# Altium schematic sheet Main.SchDoc
size A3
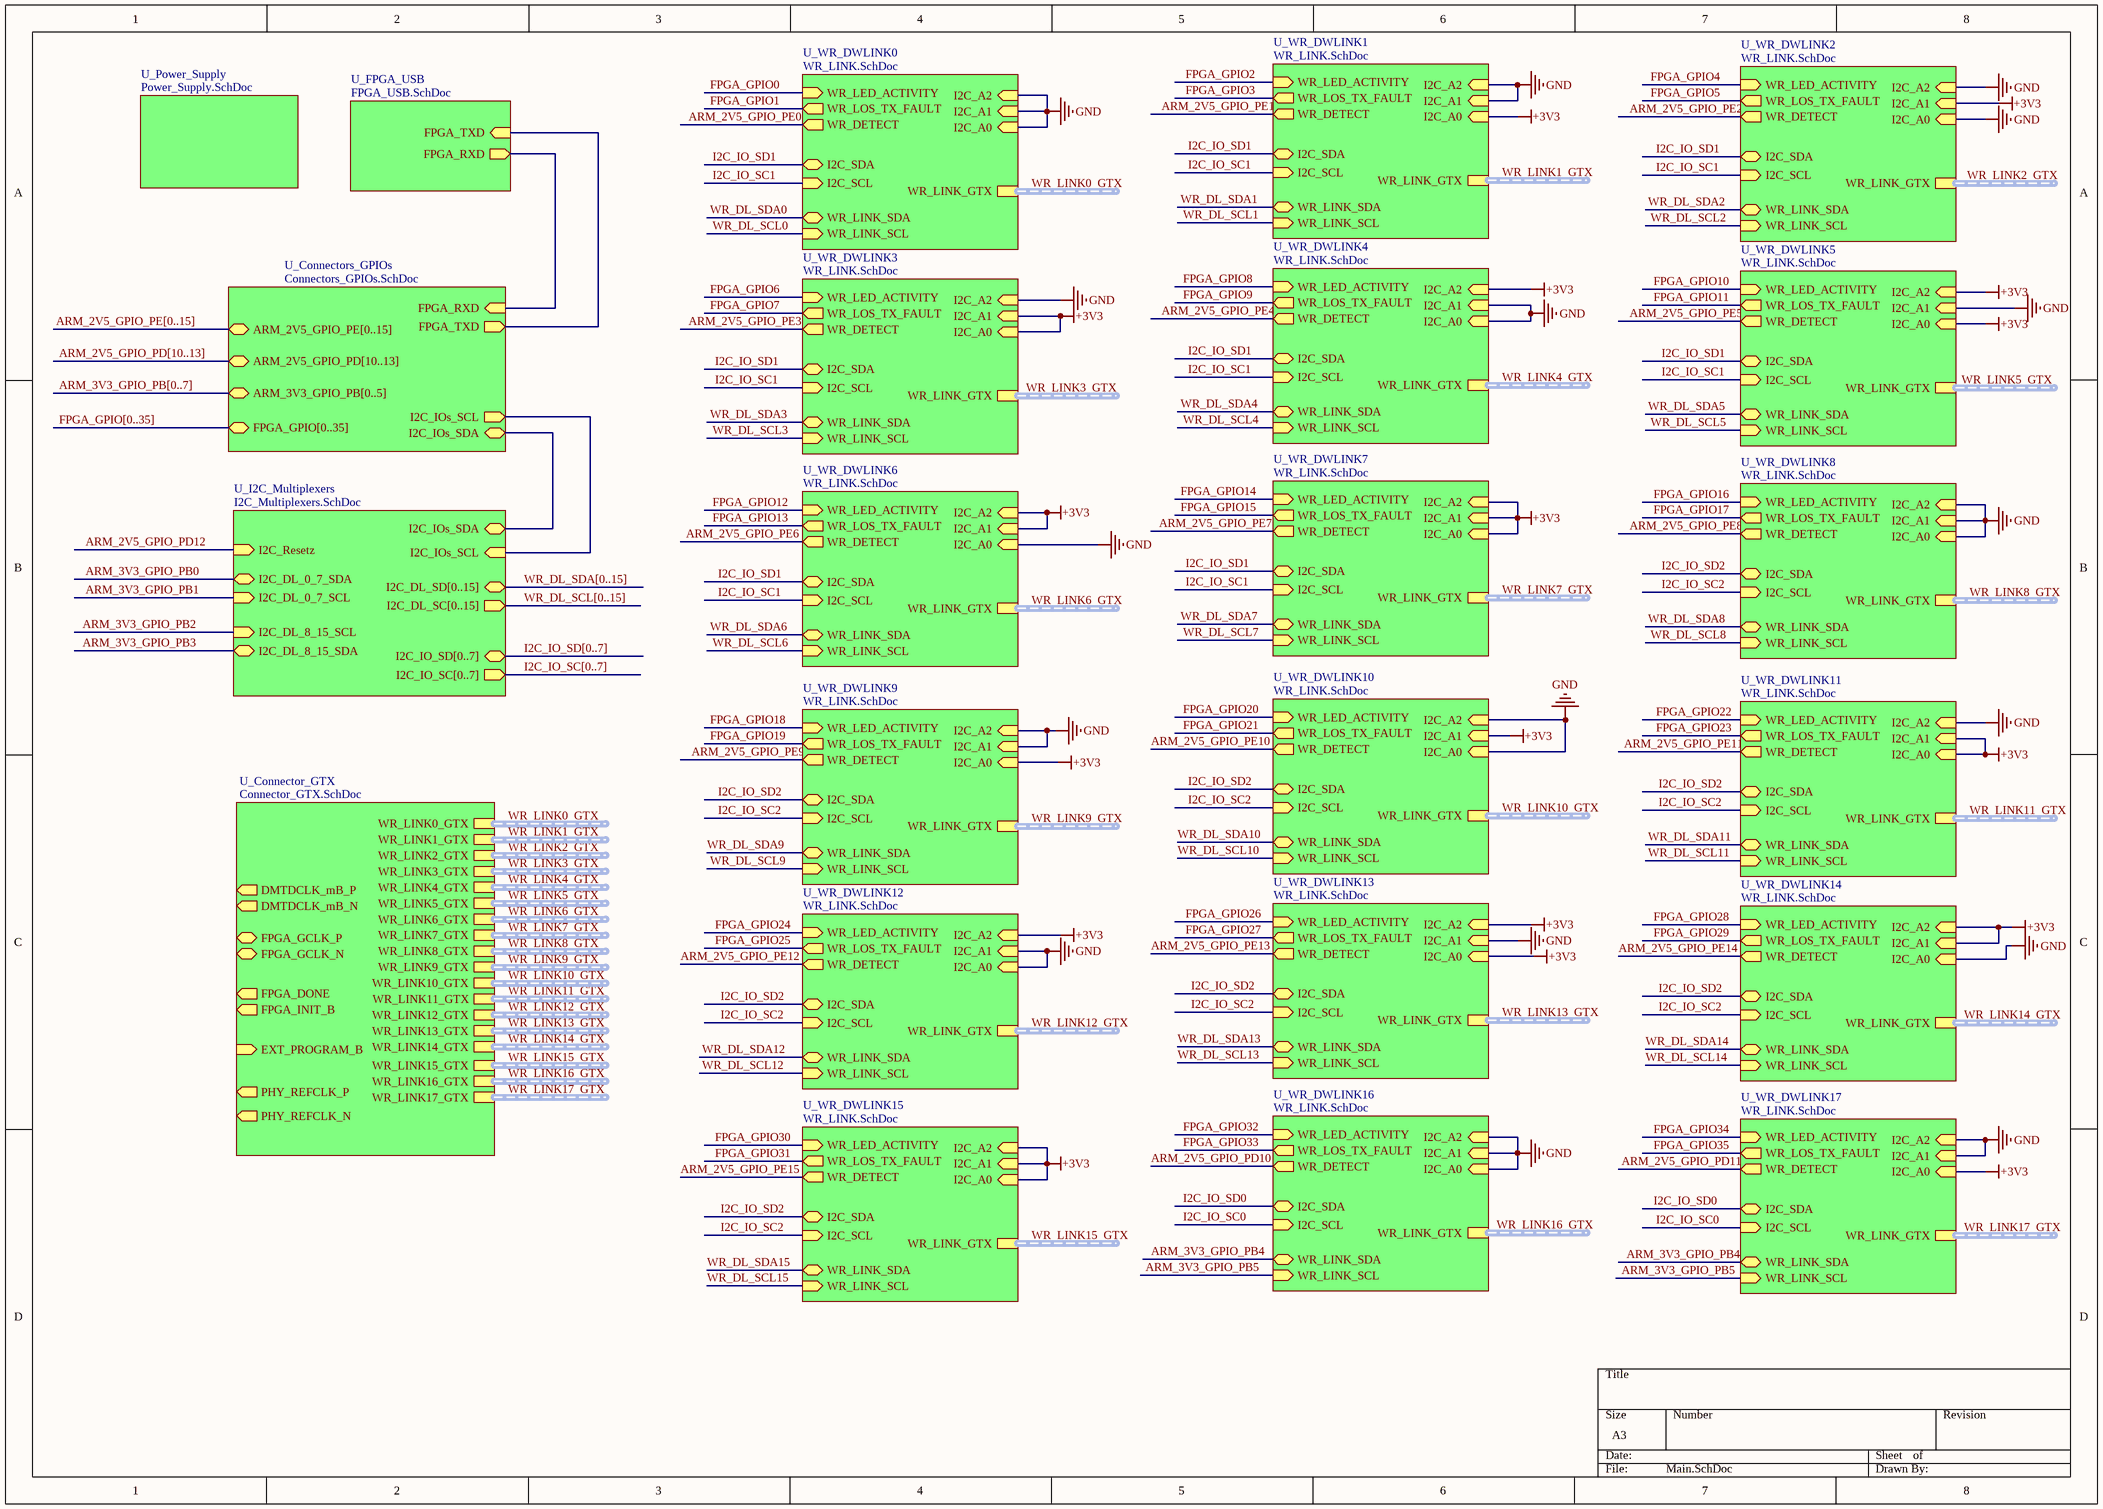
[diagram p0: Main.SchDoc]

## Sub-sheets
U_Connector_GTX = Connector_GTX.SchDoc: DMTDCLK_mB_P (out), DMTDCLK_mB_N (out), FPGA_GCLK_P (bidir), FPGA_GCLK_N (bidir), EXT_PROGRAM_B (in), FPGA_DONE (out), FPGA_INIT_B (out), PHY_REFCLK_P (out), PHY_REFCLK_N (out), WR_LINK0_GTX (harness WR_LINK_GTX), WR_LINK1_GTX (harness WR_LINK_GTX), WR_LINK2_GTX (harness WR_LINK_GTX), WR_LINK3_GTX (harness WR_LINK_GTX), WR_LINK4_GTX (harness WR_LINK_GTX), WR_LINK5_GTX (harness WR_LINK_GTX), WR_LINK6_GTX (harness WR_LINK_GTX), WR_LINK7_GTX (harness WR_LINK_GTX), WR_LINK8_GTX (harness WR_LINK_GTX), WR_LINK9_GTX (harness WR_LINK_GTX), WR_LINK10_GTX (harness WR_LINK_GTX), WR_LINK11_GTX (harness WR_LINK_GTX), WR_LINK17_GTX (harness WR_LINK_GTX), WR_LINK16_GTX (harness WR_LINK_GTX), WR_LINK15_GTX (harness WR_LINK_GTX), WR_LINK14_GTX (harness WR_LINK_GTX), WR_LINK13_GTX (harness WR_LINK_GTX), WR_LINK12_GTX (harness WR_LINK_GTX)
U_Connectors_GPIOs = Connectors_GPIOs.SchDoc: FPGA_RXD (in), FPGA_TXD (out), ARM_2V5_GPIO_PE[0..15] (bidir), FPGA_GPIO[0..35] (bidir), I2C_IOs_SCL (out), I2C_IOs_SDA (bidir), ARM_2V5_GPIO_PD[10..13] (bidir), ARM_3V3_GPIO_PB[0..5] (bidir)
U_FPGA_USB = FPGA_USB.SchDoc: FPGA_RXD (out), FPGA_TXD (in)
U_I2C_Multiplexers = I2C_Multiplexers.SchDoc: I2C_DL_SD[0..15] (bidir), I2C_DL_SC[0..15] (out), I2C_IO_SD[0..7] (bidir), I2C_IO_SC[0..7] (out), I2C_DL_0_7_SDA (bidir), I2C_DL_0_7_SCL (in), I2C_DL_8_15_SCL (in), I2C_DL_8_15_SDA (bidir), I2C_IOs_SCL (in), I2C_IOs_SDA (bidir), I2C_Resetz (in)
U_Power_Supply = Power_Supply.SchDoc: no entries
U_WR_DWLINK0 = WR_LINK.SchDoc: WR_LINK_GTX (harness WR_LINK_GTX), I2C_A0 (in), I2C_A1 (in), I2C_A2 (in), I2C_SCL (in), I2C_SDA (bidir), WR_LINK_SDA (bidir), WR_LINK_SCL (in), WR_LOS_TX_FAULT (out), WR_LED_ACTIVITY (in), WR_DETECT (out)
U_WR_DWLINK1 = WR_LINK.SchDoc: WR_LINK_GTX (harness WR_LINK_GTX), I2C_A0 (in), I2C_A1 (in), I2C_A2 (in), I2C_SCL (in), I2C_SDA (bidir), WR_LINK_SDA (bidir), WR_LINK_SCL (in), WR_LOS_TX_FAULT (out), WR_LED_ACTIVITY (in), WR_DETECT (out)
U_WR_DWLINK2 = WR_LINK.SchDoc: WR_LINK_GTX (harness WR_LINK_GTX), I2C_A0 (in), I2C_A1 (in), I2C_A2 (in), I2C_SCL (in), I2C_SDA (bidir), WR_LINK_SDA (bidir), WR_LINK_SCL (in), WR_LOS_TX_FAULT (out), WR_LED_ACTIVITY (in), WR_DETECT (out)
U_WR_DWLINK3 = WR_LINK.SchDoc: WR_LINK_GTX (harness WR_LINK_GTX), I2C_A0 (in), I2C_A1 (in), I2C_A2 (in), I2C_SCL (in), I2C_SDA (bidir), WR_LINK_SDA (bidir), WR_LINK_SCL (in), WR_LOS_TX_FAULT (out), WR_LED_ACTIVITY (in), WR_DETECT (out)
U_WR_DWLINK4 = WR_LINK.SchDoc: WR_LINK_GTX (harness WR_LINK_GTX), I2C_A0 (in), I2C_A1 (in), I2C_A2 (in), I2C_SCL (in), I2C_SDA (bidir), WR_LINK_SDA (bidir), WR_LINK_SCL (in), WR_LOS_TX_FAULT (out), WR_LED_ACTIVITY (in), WR_DETECT (out)
U_WR_DWLINK5 = WR_LINK.SchDoc: WR_LINK_GTX (harness WR_LINK_GTX), I2C_A0 (in), I2C_A1 (in), I2C_A2 (in), I2C_SCL (in), I2C_SDA (bidir), WR_LINK_SDA (bidir), WR_LINK_SCL (in), WR_LOS_TX_FAULT (out), WR_LED_ACTIVITY (in), WR_DETECT (out)
U_WR_DWLINK6 = WR_LINK.SchDoc: WR_LINK_GTX (harness WR_LINK_GTX), I2C_A0 (in), I2C_A1 (in), I2C_A2 (in), I2C_SCL (in), I2C_SDA (bidir), WR_LINK_SDA (bidir), WR_LINK_SCL (in), WR_LOS_TX_FAULT (out), WR_LED_ACTIVITY (in), WR_DETECT (out)
U_WR_DWLINK7 = WR_LINK.SchDoc: WR_LINK_GTX (harness WR_LINK_GTX), I2C_A0 (in), I2C_A1 (in), I2C_A2 (in), I2C_SCL (in), I2C_SDA (bidir), WR_LINK_SDA (bidir), WR_LINK_SCL (in), WR_LOS_TX_FAULT (out), WR_LED_ACTIVITY (in), WR_DETECT (out)
U_WR_DWLINK8 = WR_LINK.SchDoc: WR_LINK_GTX (harness WR_LINK_GTX), I2C_A0 (in), I2C_A1 (in), I2C_A2 (in), I2C_SCL (in), I2C_SDA (bidir), WR_LINK_SDA (bidir), WR_LINK_SCL (in), WR_LOS_TX_FAULT (out), WR_LED_ACTIVITY (in), WR_DETECT (out)
U_WR_DWLINK9 = WR_LINK.SchDoc: WR_LINK_GTX (harness WR_LINK_GTX), I2C_A0 (in), I2C_A1 (in), I2C_A2 (in), I2C_SCL (in), I2C_SDA (bidir), WR_LINK_SDA (bidir), WR_LINK_SCL (in), WR_LOS_TX_FAULT (out), WR_LED_ACTIVITY (in), WR_DETECT (out)
U_WR_DWLINK10 = WR_LINK.SchDoc: WR_LINK_GTX (harness WR_LINK_GTX), I2C_A0 (in), I2C_A1 (in), I2C_A2 (in), I2C_SCL (in), I2C_SDA (bidir), WR_LINK_SDA (bidir), WR_LINK_SCL (in), WR_LOS_TX_FAULT (out), WR_LED_ACTIVITY (in), WR_DETECT (out)
U_WR_DWLINK11 = WR_LINK.SchDoc: WR_LINK_GTX (harness WR_LINK_GTX), I2C_A0 (in), I2C_A1 (in), I2C_A2 (in), I2C_SCL (in), I2C_SDA (bidir), WR_LINK_SDA (bidir), WR_LINK_SCL (in), WR_LOS_TX_FAULT (out), WR_LED_ACTIVITY (in), WR_DETECT (out)
U_WR_DWLINK12 = WR_LINK.SchDoc: WR_LINK_GTX (harness WR_LINK_GTX), I2C_A0 (in), I2C_A1 (in), I2C_A2 (in), I2C_SCL (in), I2C_SDA (bidir), WR_LINK_SDA (bidir), WR_LINK_SCL (in), WR_LOS_TX_FAULT (out), WR_LED_ACTIVITY (in), WR_DETECT (out)
U_WR_DWLINK13 = WR_LINK.SchDoc: WR_LINK_GTX (harness WR_LINK_GTX), I2C_A0 (in), I2C_A1 (in), I2C_A2 (in), I2C_SCL (in), I2C_SDA (bidir), WR_LINK_SDA (bidir), WR_LINK_SCL (in), WR_LOS_TX_FAULT (out), WR_LED_ACTIVITY (in), WR_DETECT (out)
U_WR_DWLINK14 = WR_LINK.SchDoc: WR_LINK_GTX (harness WR_LINK_GTX), I2C_A0 (in), I2C_A1 (in), I2C_A2 (in), I2C_SCL (in), I2C_SDA (bidir), WR_LINK_SDA (bidir), WR_LINK_SCL (in), WR_LOS_TX_FAULT (out), WR_LED_ACTIVITY (in), WR_DETECT (out)
U_WR_DWLINK15 = WR_LINK.SchDoc: WR_LINK_GTX (harness WR_LINK_GTX), I2C_A0 (in), I2C_A1 (in), I2C_A2 (in), I2C_SCL (in), I2C_SDA (bidir), WR_LINK_SDA (bidir), WR_LINK_SCL (in), WR_LOS_TX_FAULT (out), WR_LED_ACTIVITY (in), WR_DETECT (out)
U_WR_DWLINK16 = WR_LINK.SchDoc: WR_LINK_GTX (harness WR_LINK_GTX), I2C_A0 (in), I2C_A1 (in), I2C_A2 (in), I2C_SCL (in), I2C_SDA (bidir), WR_LINK_SDA (bidir), WR_LINK_SCL (in), WR_LOS_TX_FAULT (out), WR_LED_ACTIVITY (in), WR_DETECT (out)
U_WR_DWLINK17 = WR_LINK.SchDoc: WR_LINK_GTX (harness WR_LINK_GTX), I2C_A0 (in), I2C_A1 (in), I2C_A2 (in), I2C_SCL (in), I2C_SDA (bidir), WR_LINK_SDA (bidir), WR_LINK_SCL (in), WR_LOS_TX_FAULT (out), WR_LED_ACTIVITY (in), WR_DETECT (out)

## Nets
+3V3: sheet U_WR_DWLINK1/I2C_A0, sheet U_WR_DWLINK2/I2C_A1, sheet U_WR_DWLINK3/I2C_A0, sheet U_WR_DWLINK3/I2C_A1, sheet U_WR_DWLINK4/I2C_A2, sheet U_WR_DWLINK5/I2C_A0, sheet U_WR_DWLINK5/I2C_A2, sheet U_WR_DWLINK11/I2C_A0, sheet U_WR_DWLINK11/I2C_A1, sheet U_WR_DWLINK14/I2C_A1, sheet U_WR_DWLINK14/I2C_A2, sheet U_WR_DWLINK17/I2C_A0, sheet U_WR_DWLINK13/I2C_A0, sheet U_WR_DWLINK13/I2C_A2, sheet U_WR_DWLINK10/I2C_A1, sheet U_WR_DWLINK7/I2C_A0, sheet U_WR_DWLINK7/I2C_A1, sheet U_WR_DWLINK7/I2C_A2, sheet U_WR_DWLINK6/I2C_A1, sheet U_WR_DWLINK6/I2C_A2, sheet U_WR_DWLINK9/I2C_A0, sheet U_WR_DWLINK12/I2C_A2, sheet U_WR_DWLINK15/I2C_A0, sheet U_WR_DWLINK15/I2C_A1, sheet U_WR_DWLINK15/I2C_A2
GND: sheet U_WR_DWLINK0/I2C_A0, sheet U_WR_DWLINK0/I2C_A1, sheet U_WR_DWLINK0/I2C_A2, sheet U_WR_DWLINK1/I2C_A1, sheet U_WR_DWLINK1/I2C_A2, sheet U_WR_DWLINK2/I2C_A0, sheet U_WR_DWLINK2/I2C_A2, sheet U_WR_DWLINK3/I2C_A2, sheet U_WR_DWLINK4/I2C_A0, sheet U_WR_DWLINK4/I2C_A1, sheet U_WR_DWLINK5/I2C_A1, sheet U_WR_DWLINK8/I2C_A0, sheet U_WR_DWLINK8/I2C_A1, sheet U_WR_DWLINK8/I2C_A2, sheet U_WR_DWLINK11/I2C_A2, sheet U_WR_DWLINK14/I2C_A0, sheet U_WR_DWLINK17/I2C_A1, sheet U_WR_DWLINK17/I2C_A2, sheet U_WR_DWLINK16/I2C_A0, sheet U_WR_DWLINK16/I2C_A1, sheet U_WR_DWLINK16/I2C_A2, sheet U_WR_DWLINK13/I2C_A1, sheet U_WR_DWLINK10/I2C_A0, sheet U_WR_DWLINK10/I2C_A2, sheet U_WR_DWLINK6/I2C_A0, sheet U_WR_DWLINK9/I2C_A1, sheet U_WR_DWLINK9/I2C_A2, sheet U_WR_DWLINK12/I2C_A0, sheet U_WR_DWLINK12/I2C_A1
ARM_2V5_GPIO_PD10: sheet U_WR_DWLINK16/WR_DETECT
ARM_2V5_GPIO_PD11: sheet U_WR_DWLINK17/WR_DETECT
ARM_2V5_GPIO_PD12: sheet U_I2C_Multiplexers/I2C_Resetz
ARM_2V5_GPIO_PE0: sheet U_WR_DWLINK0/WR_DETECT
ARM_2V5_GPIO_PE1: sheet U_WR_DWLINK1/WR_DETECT
ARM_2V5_GPIO_PE2: sheet U_WR_DWLINK2/WR_DETECT
ARM_2V5_GPIO_PE3: sheet U_WR_DWLINK3/WR_DETECT
ARM_2V5_GPIO_PE4: sheet U_WR_DWLINK4/WR_DETECT
ARM_2V5_GPIO_PE5: sheet U_WR_DWLINK5/WR_DETECT
ARM_2V5_GPIO_PE6: sheet U_WR_DWLINK6/WR_DETECT
ARM_2V5_GPIO_PE7: sheet U_WR_DWLINK7/WR_DETECT
ARM_2V5_GPIO_PE8: sheet U_WR_DWLINK8/WR_DETECT
ARM_2V5_GPIO_PE9: sheet U_WR_DWLINK9/WR_DETECT
ARM_2V5_GPIO_PE10: sheet U_WR_DWLINK10/WR_DETECT
ARM_2V5_GPIO_PE11: sheet U_WR_DWLINK11/WR_DETECT
ARM_2V5_GPIO_PE12: sheet U_WR_DWLINK12/WR_DETECT
ARM_2V5_GPIO_PE13: sheet U_WR_DWLINK13/WR_DETECT
ARM_2V5_GPIO_PE14: sheet U_WR_DWLINK14/WR_DETECT
ARM_2V5_GPIO_PE15: sheet U_WR_DWLINK15/WR_DETECT
ARM_3V3_GPIO_PB0: sheet U_I2C_Multiplexers/I2C_DL_0_7_SDA
ARM_3V3_GPIO_PB1: sheet U_I2C_Multiplexers/I2C_DL_0_7_SCL
ARM_3V3_GPIO_PB2: sheet U_I2C_Multiplexers/I2C_DL_8_15_SCL
ARM_3V3_GPIO_PB3: sheet U_I2C_Multiplexers/I2C_DL_8_15_SDA
ARM_3V3_GPIO_PB4: sheet U_WR_DWLINK17/WR_LINK_SDA, sheet U_WR_DWLINK16/WR_LINK_SDA
ARM_3V3_GPIO_PB5: sheet U_WR_DWLINK17/WR_LINK_SCL, sheet U_WR_DWLINK16/WR_LINK_SCL
FPGA_GPIO0: sheet U_WR_DWLINK0/WR_LED_ACTIVITY
FPGA_GPIO1: sheet U_WR_DWLINK0/WR_LOS_TX_FAULT
FPGA_GPIO2: sheet U_WR_DWLINK1/WR_LED_ACTIVITY
FPGA_GPIO3: sheet U_WR_DWLINK1/WR_LOS_TX_FAULT
FPGA_GPIO4: sheet U_WR_DWLINK2/WR_LED_ACTIVITY
FPGA_GPIO5: sheet U_WR_DWLINK2/WR_LOS_TX_FAULT
FPGA_GPIO6: sheet U_WR_DWLINK3/WR_LED_ACTIVITY
FPGA_GPIO7: sheet U_WR_DWLINK3/WR_LOS_TX_FAULT
FPGA_GPIO8: sheet U_WR_DWLINK4/WR_LED_ACTIVITY
FPGA_GPIO9: sheet U_WR_DWLINK4/WR_LOS_TX_FAULT
FPGA_GPIO10: sheet U_WR_DWLINK5/WR_LED_ACTIVITY
FPGA_GPIO11: sheet U_WR_DWLINK5/WR_LOS_TX_FAULT
FPGA_GPIO12: sheet U_WR_DWLINK6/WR_LED_ACTIVITY
FPGA_GPIO13: sheet U_WR_DWLINK6/WR_LOS_TX_FAULT
FPGA_GPIO14: sheet U_WR_DWLINK7/WR_LED_ACTIVITY
FPGA_GPIO15: sheet U_WR_DWLINK7/WR_LOS_TX_FAULT
FPGA_GPIO16: sheet U_WR_DWLINK8/WR_LED_ACTIVITY
FPGA_GPIO17: sheet U_WR_DWLINK8/WR_LOS_TX_FAULT
FPGA_GPIO18: sheet U_WR_DWLINK9/WR_LED_ACTIVITY
FPGA_GPIO19: sheet U_WR_DWLINK9/WR_LOS_TX_FAULT
FPGA_GPIO20: sheet U_WR_DWLINK10/WR_LED_ACTIVITY
FPGA_GPIO21: sheet U_WR_DWLINK10/WR_LOS_TX_FAULT
FPGA_GPIO22: sheet U_WR_DWLINK11/WR_LED_ACTIVITY
FPGA_GPIO23: sheet U_WR_DWLINK11/WR_LOS_TX_FAULT
FPGA_GPIO24: sheet U_WR_DWLINK12/WR_LED_ACTIVITY
FPGA_GPIO25: sheet U_WR_DWLINK12/WR_LOS_TX_FAULT
FPGA_GPIO26: sheet U_WR_DWLINK13/WR_LED_ACTIVITY
FPGA_GPIO27: sheet U_WR_DWLINK13/WR_LOS_TX_FAULT
FPGA_GPIO28: sheet U_WR_DWLINK14/WR_LED_ACTIVITY
FPGA_GPIO29: sheet U_WR_DWLINK14/WR_LOS_TX_FAULT
FPGA_GPIO30: sheet U_WR_DWLINK15/WR_LED_ACTIVITY
FPGA_GPIO31: sheet U_WR_DWLINK15/WR_LOS_TX_FAULT
FPGA_GPIO32: sheet U_WR_DWLINK16/WR_LED_ACTIVITY
FPGA_GPIO33: sheet U_WR_DWLINK16/WR_LOS_TX_FAULT
FPGA_GPIO34: sheet U_WR_DWLINK17/WR_LED_ACTIVITY
FPGA_GPIO35: sheet U_WR_DWLINK17/WR_LOS_TX_FAULT
I2C_IO_SC0: sheet U_WR_DWLINK17/I2C_SCL, sheet U_WR_DWLINK16/I2C_SCL
I2C_IO_SC1: sheet U_WR_DWLINK0/I2C_SCL, sheet U_WR_DWLINK1/I2C_SCL, sheet U_WR_DWLINK2/I2C_SCL, sheet U_WR_DWLINK3/I2C_SCL, sheet U_WR_DWLINK4/I2C_SCL, sheet U_WR_DWLINK5/I2C_SCL, sheet U_WR_DWLINK7/I2C_SCL, sheet U_WR_DWLINK6/I2C_SCL
I2C_IO_SC2: sheet U_WR_DWLINK8/I2C_SCL, sheet U_WR_DWLINK11/I2C_SCL, sheet U_WR_DWLINK14/I2C_SCL, sheet U_WR_DWLINK13/I2C_SCL, sheet U_WR_DWLINK10/I2C_SCL, sheet U_WR_DWLINK9/I2C_SCL, sheet U_WR_DWLINK12/I2C_SCL, sheet U_WR_DWLINK15/I2C_SCL
I2C_IO_SD0: sheet U_WR_DWLINK17/I2C_SDA, sheet U_WR_DWLINK16/I2C_SDA
I2C_IO_SD1: sheet U_WR_DWLINK0/I2C_SDA, sheet U_WR_DWLINK1/I2C_SDA, sheet U_WR_DWLINK2/I2C_SDA, sheet U_WR_DWLINK3/I2C_SDA, sheet U_WR_DWLINK4/I2C_SDA, sheet U_WR_DWLINK5/I2C_SDA, sheet U_WR_DWLINK7/I2C_SDA, sheet U_WR_DWLINK6/I2C_SDA
I2C_IO_SD2: sheet U_WR_DWLINK8/I2C_SDA, sheet U_WR_DWLINK11/I2C_SDA, sheet U_WR_DWLINK14/I2C_SDA, sheet U_WR_DWLINK13/I2C_SDA, sheet U_WR_DWLINK10/I2C_SDA, sheet U_WR_DWLINK9/I2C_SDA, sheet U_WR_DWLINK12/I2C_SDA, sheet U_WR_DWLINK15/I2C_SDA
WR_DL_SCL0: sheet U_WR_DWLINK0/WR_LINK_SCL
WR_DL_SCL1: sheet U_WR_DWLINK1/WR_LINK_SCL
WR_DL_SCL2: sheet U_WR_DWLINK2/WR_LINK_SCL
WR_DL_SCL3: sheet U_WR_DWLINK3/WR_LINK_SCL
WR_DL_SCL4: sheet U_WR_DWLINK4/WR_LINK_SCL
WR_DL_SCL5: sheet U_WR_DWLINK5/WR_LINK_SCL
WR_DL_SCL6: sheet U_WR_DWLINK6/WR_LINK_SCL
WR_DL_SCL7: sheet U_WR_DWLINK7/WR_LINK_SCL
WR_DL_SCL8: sheet U_WR_DWLINK8/WR_LINK_SCL
WR_DL_SCL9: sheet U_WR_DWLINK9/WR_LINK_SCL
WR_DL_SCL10: sheet U_WR_DWLINK10/WR_LINK_SCL
WR_DL_SCL11: sheet U_WR_DWLINK11/WR_LINK_SCL
WR_DL_SCL12: sheet U_WR_DWLINK12/WR_LINK_SCL
WR_DL_SCL13: sheet U_WR_DWLINK13/WR_LINK_SCL
WR_DL_SCL14: sheet U_WR_DWLINK14/WR_LINK_SCL
WR_DL_SCL15: sheet U_WR_DWLINK15/WR_LINK_SCL
WR_DL_SDA0: sheet U_WR_DWLINK0/WR_LINK_SDA
WR_DL_SDA1: sheet U_WR_DWLINK1/WR_LINK_SDA
WR_DL_SDA2: sheet U_WR_DWLINK2/WR_LINK_SDA
WR_DL_SDA3: sheet U_WR_DWLINK3/WR_LINK_SDA
WR_DL_SDA4: sheet U_WR_DWLINK4/WR_LINK_SDA
WR_DL_SDA5: sheet U_WR_DWLINK5/WR_LINK_SDA
WR_DL_SDA6: sheet U_WR_DWLINK6/WR_LINK_SDA
WR_DL_SDA7: sheet U_WR_DWLINK7/WR_LINK_SDA
WR_DL_SDA8: sheet U_WR_DWLINK8/WR_LINK_SDA
WR_DL_SDA9: sheet U_WR_DWLINK9/WR_LINK_SDA
WR_DL_SDA10: sheet U_WR_DWLINK10/WR_LINK_SDA
WR_DL_SDA11: sheet U_WR_DWLINK11/WR_LINK_SDA
WR_DL_SDA12: sheet U_WR_DWLINK12/WR_LINK_SDA
WR_DL_SDA13: sheet U_WR_DWLINK13/WR_LINK_SDA
WR_DL_SDA14: sheet U_WR_DWLINK14/WR_LINK_SDA
WR_DL_SDA15: sheet U_WR_DWLINK15/WR_LINK_SDA
(unnamed): sheet U_I2C_Multiplexers/I2C_IOs_SCL, sheet U_Connectors_GPIOs/I2C_IOs_SCL
(unnamed): sheet U_I2C_Multiplexers/I2C_IOs_SDA, sheet U_Connectors_GPIOs/I2C_IOs_SDA
(unnamed): sheet U_Connectors_GPIOs/FPGA_RXD, sheet U_FPGA_USB/FPGA_RXD
(unnamed): sheet U_Connectors_GPIOs/FPGA_TXD, sheet U_FPGA_USB/FPGA_TXD

## Buses and harness runs
bus ARM_2V5_GPIO_PD[10..13] = sheet U_Connectors_GPIOs/ARM_2V5_GPIO_PD[10..13]
bus ARM_2V5_GPIO_PE[0..15] = sheet U_Connectors_GPIOs/ARM_2V5_GPIO_PE[0..15]
bus ARM_3V3_GPIO_PB[0..7] = sheet U_Connectors_GPIOs/ARM_3V3_GPIO_PB[0..5]
bus FPGA_GPIO[0..35] = sheet U_Connectors_GPIOs/FPGA_GPIO[0..35]
bus I2C_IO_SC[0..7] = sheet U_I2C_Multiplexers/I2C_IO_SC[0..7]
bus I2C_IO_SD[0..7] = sheet U_I2C_Multiplexers/I2C_IO_SD[0..7]
bus WR_DL_SCL[0..15] = sheet U_I2C_Multiplexers/I2C_DL_SC[0..15]
bus WR_DL_SDA[0..15] = sheet U_I2C_Multiplexers/I2C_DL_SD[0..15]
harness WR_LINK0_GTX = sheet U_Connector_GTX/WR_LINK0_GTX
harness WR_LINK0_GTX = sheet U_WR_DWLINK0/WR_LINK_GTX
harness WR_LINK1_GTX = sheet U_Connector_GTX/WR_LINK1_GTX
harness WR_LINK1_GTX = sheet U_WR_DWLINK1/WR_LINK_GTX
harness WR_LINK2_GTX = sheet U_Connector_GTX/WR_LINK2_GTX
harness WR_LINK2_GTX = sheet U_WR_DWLINK2/WR_LINK_GTX
harness WR_LINK3_GTX = sheet U_Connector_GTX/WR_LINK3_GTX
harness WR_LINK3_GTX = sheet U_WR_DWLINK3/WR_LINK_GTX
harness WR_LINK4_GTX = sheet U_Connector_GTX/WR_LINK4_GTX
harness WR_LINK4_GTX = sheet U_WR_DWLINK4/WR_LINK_GTX
harness WR_LINK5_GTX = sheet U_Connector_GTX/WR_LINK5_GTX
harness WR_LINK5_GTX = sheet U_WR_DWLINK5/WR_LINK_GTX
harness WR_LINK6_GTX = sheet U_Connector_GTX/WR_LINK6_GTX
harness WR_LINK6_GTX = sheet U_WR_DWLINK6/WR_LINK_GTX
harness WR_LINK7_GTX = sheet U_Connector_GTX/WR_LINK7_GTX
harness WR_LINK7_GTX = sheet U_WR_DWLINK7/WR_LINK_GTX
harness WR_LINK8_GTX = sheet U_Connector_GTX/WR_LINK8_GTX
harness WR_LINK8_GTX = sheet U_WR_DWLINK8/WR_LINK_GTX
harness WR_LINK9_GTX = sheet U_Connector_GTX/WR_LINK9_GTX
harness WR_LINK9_GTX = sheet U_WR_DWLINK9/WR_LINK_GTX
harness WR_LINK10_GTX = sheet U_Connector_GTX/WR_LINK10_GTX
harness WR_LINK10_GTX = sheet U_WR_DWLINK10/WR_LINK_GTX
harness WR_LINK11_GTX = sheet U_Connector_GTX/WR_LINK11_GTX
harness WR_LINK11_GTX = sheet U_WR_DWLINK11/WR_LINK_GTX
harness WR_LINK12_GTX = sheet U_Connector_GTX/WR_LINK12_GTX
harness WR_LINK12_GTX = sheet U_WR_DWLINK12/WR_LINK_GTX
harness WR_LINK13_GTX = sheet U_Connector_GTX/WR_LINK13_GTX
harness WR_LINK13_GTX = sheet U_WR_DWLINK13/WR_LINK_GTX
harness WR_LINK14_GTX = sheet U_Connector_GTX/WR_LINK14_GTX
harness WR_LINK14_GTX = sheet U_WR_DWLINK14/WR_LINK_GTX
harness WR_LINK15_GTX = sheet U_Connector_GTX/WR_LINK15_GTX
harness WR_LINK15_GTX = sheet U_WR_DWLINK15/WR_LINK_GTX
harness WR_LINK16_GTX = sheet U_Connector_GTX/WR_LINK16_GTX
harness WR_LINK16_GTX = sheet U_WR_DWLINK16/WR_LINK_GTX
harness WR_LINK17_GTX = sheet U_Connector_GTX/WR_LINK17_GTX
harness WR_LINK17_GTX = sheet U_WR_DWLINK17/WR_LINK_GTX